# Altium schematic sheet SCH.schdoc: AT long bus (13.3 x 4.2 inches)
size A; Organization: Organization; Address1: Address1; Address2: Address2; Address3: Address3; Address4: Address4; DocumentNumber: 1; Revision: 0; SheetNumber: 2; SheetTotal: 2
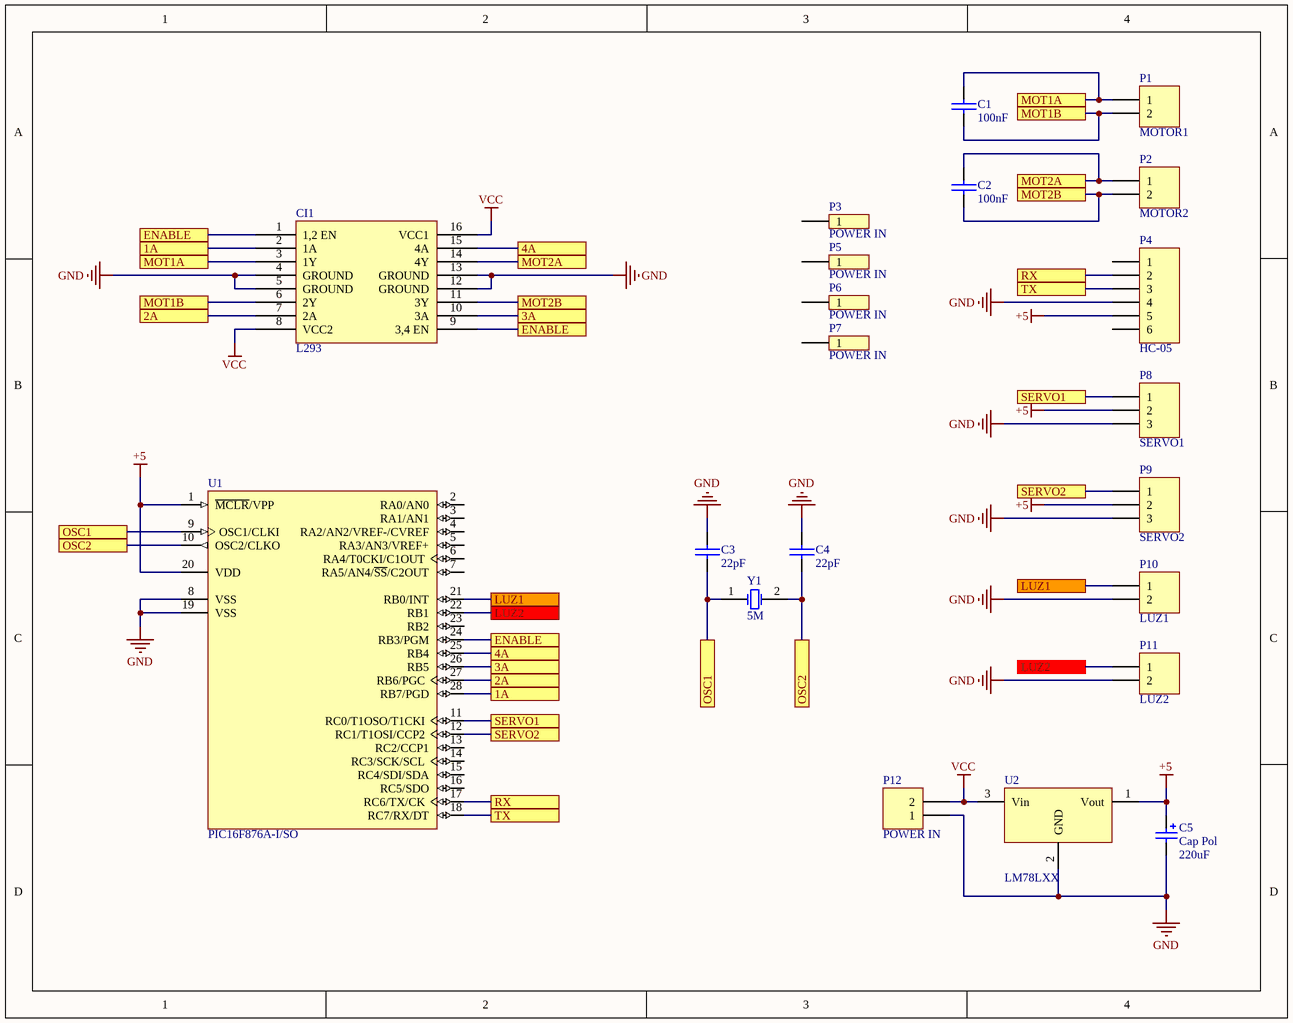
[diagram p0: SCH.schdoc]

## Parts
C1  100nF  [CAP0.15]
C2  100nF  [CAP0.15]
C3  22pF  [CAP0.15]
C4  22pF  [CAP0.15]
C5  Cap Pol  value 220uF  [ELECTROLITICO 5X10]
CI1  L293  [DIP16]
P1  MOTOR1  [BORNERA2 azul]
P2  MOTOR2  [BORNERA2 azul]
P3  POWER IN  [TORNILLO]
P4  HC-05  [Header 1X6]
P5  POWER IN  [TORNILLO]
P6  POWER IN  [TORNILLO]
P7  POWER IN  [TORNILLO]
P8  SERVO1  [Header 1X3]
P9  SERVO2  [Header 1X3]
P10  LUZ1  [HEADER1X2]
P11  LUZ2  [HEADER1X2]
P12  POWER IN  [BORNERA2 azul]
U1  PIC16F876A-I/SO  [DIP28]
U2  LM78LXX  [TO220]
Y1  5M  [HP49-S]

## Ports
1A, 2A, 3A, 4A, ENABLE, LUZ1, LUZ2, MOT1A, MOT1B, MOT2A, MOT2B, OSC1, OSC2, RX, SERVO1, SERVO2, TX

## Nets
+5: C5.1 P4.5 P8.2 P9.2 U1.1(~{MCLR}/VPP) U1.20(VDD) U2.1(Vout)
GND: C3.1 C4.1 C5.2 CI1.4(GROUND) CI1.5(GROUND) CI1.12(GROUND) CI1.13(GROUND) P4.4 P8.3 P9.3 P10.2 P11.2 P12.1 U1.8(VSS) U1.19(VSS) U2.2(GND)
VCC: CI1.8(VCC2) CI1.16(VCC1) P12.2 U2.3(Vin)
1A: CI1.2(1A) U1.28(RB7/PGD) ; port 1A
2A: CI1.7(2A) U1.27(RB6/PGC) ; port 2A
3A: CI1.10(3A) U1.26(RB5) ; port 3A
4A: CI1.15(4A) U1.25(RB4) ; port 4A
ENABLE: CI1.1(1,2_EN) CI1.9(3,4_EN) U1.24(RB3/PGM) ; port ENABLE
LUZ1: P10.1 U1.21(RB0/INT) ; port LUZ1
LUZ2: P11.1 U1.22(RB1) ; port LUZ2
MOT1A: C1.1 CI1.3(1Y) P1.1 ; port MOT1A
MOT1B: C1.2 CI1.6(2Y) P1.2 ; port MOT1B
MOT2A: C2.1 CI1.14(4Y) P2.1 ; port MOT2A
MOT2B: C2.2 CI1.11(3Y) P2.2 ; port MOT2B
OSC1: C3.2 U1.9(OSC1/CLKI) Y1.1(OSC1) ; port OSC1
OSC2: C4.2 U1.10(OSC2/CLKO) Y1.2(OSC2) ; port OSC2
RX: P4.2 U1.17(RC6/TX/CK) ; port RX
SERVO1: P8.1 U1.11(RC0/T1OSO/T1CKI) ; port SERVO1
SERVO2: P9.1 U1.12(RC1/T1OSI/CCP2) ; port SERVO2
TX: P4.3 U1.18(RC7/RX/DT) ; port TX

Not connected (* = marked no-connect by the designer): P3 1; P4 1 6; P5 1; P6 1; P7 1; U1 2(RA0/AN0) 3(RA1/AN1) 4(RA2/AN2/VREF-/CVREF) 5(RA3/AN3/VREF+) 6(RA4/T0CKI/C1OUT) 7(RA5/AN4/~{SS}/C2OUT) 13(RC2/CCP1) 14(RC3/SCK/SCL) 15(RC4/SDI/SDA) 16(RC5/SDO) 23(RB2)

## Library data of the parts
C1-C4 = CAP
C5 = Cap Pol: Polarized Capacitor (Surface Mount); Published: 8-Jun-2000; LatestRevisionDate: 17-Jul-2002; LatestRevisionNote: Re-released for DXP Platform.; PackageReference: C0805; Publisher: Altium Limited
CI1 = L293: Driver_Motor; Published: 8-Jun-2000; LatestRevisionDate: 17-Jul-2002; LatestRevisionNote: Re-released for DXP Platform.; PackageReference: SOT-23B; Publisher: Altium Limited; Code_JEDEC: SOT-23
P1 P2 P10-P12 = Header 2: Header, 2-Pin; LatestRevisionDate: 17-Jul-2002; LatestRevisionNote: Re-released for DXP Platform.; Publisher: Altium Limited
P3 P5-P7 = Header 1: Header, 2-Pin; LatestRevisionDate: 17-Jul-2002; LatestRevisionNote: Re-released for DXP Platform.; Publisher: Altium Limited
P4 = Header 6: Header, 6-Pin; LatestRevisionDate: 17-Jul-2002; LatestRevisionNote: Re-released for DXP Platform.; Publisher: Altium Limited
P8 P9 = Header 3: Header, 3-Pin; LatestRevisionDate: 17-Jul-2002; LatestRevisionNote: Re-released for DXP Platform.; Publisher: Altium Limited
U1 = PIC16F876A-I/SO: Enhanced FLASH Microcontroller, 8K (x14-Bit words) FLASH, 368 Bytes RAM, 28-Pin SOIC, Standard VDD Range, Industrial Temperature; ComponentAvailability: Unknown. Contact manufacturer to determine status.; Published: 11-Oct-2004; LatestRevisionDate: 29-Jan-2009; LatestRevisionNote: Sch. layout revised. 3D Model Removed.; DatasheetVersion: revB, Oct-2003; PackageVersion: revBB, Aug-2009; PackageReference: SOIC-SO28; Publisher: Altium Limited; PackageDescription: 28-Lead Plastic Small Outline (SO) - Wide 7.50mm Body [SOIC]; Supplier 1: Digi-Key; Supplier Part Number 1: PIC16F876A-I/SO-ND; Supplier 2: Farnell; Supplier Part Number 2: 9761306; Supplier 3: Farnell; Supplier Part Number 3: 1660040; Code_JEDEC: MS-013; ComponentLink1Description: Datasheet; ComponentLink1URL: http://ww1.microchip.com/downloads/en/DeviceDoc/39582b.pdf; ComponentLink2Description: Packaging Specification; ComponentLink2URL: http://www.microchip.com/stellent/groups/techpub_sg/documents/packagingspec/en012702.pdf; ComponentLink3Description: Microchip.com Home; ComponentLink3URL: http://www.microchip.com/
Y1 = XTAL: Crystal Oscillator; Published: 8-Jun-2000; LatestRevisionDate: 17-Jul-2002; LatestRevisionNote: Re-released for DXP Platform.; PackageReference: R38; Publisher: Altium Limited